# Altium project WR_Cute_Carrier.PrjPcb (part 2 of 2)

## Sheet USB_Serial_Quad.SchDoc: WR_Cute_Carrier
size 420 x 297 mm; Author: G.Kasprowicz; CompanyName: WUT ISE; DrawnBy: G.Kasprowicz; Organization: WUT ISE; Address1: PW ISE; Address2: Nowowiejska 15/19 00-665 Warsaw; Address3: gkasprow@gmail.com; DocumentNumber: 5; Revision: 1; SheetNumber: 5; SheetTotal: 7; ModifiedBy: -; CheckedDate: -; Title2: USB_Serial_Quad; DivGrp: WUT ISE; Designer: G.Kasprowicz; ModifiedDate: -; ProjectName: Sensor Box
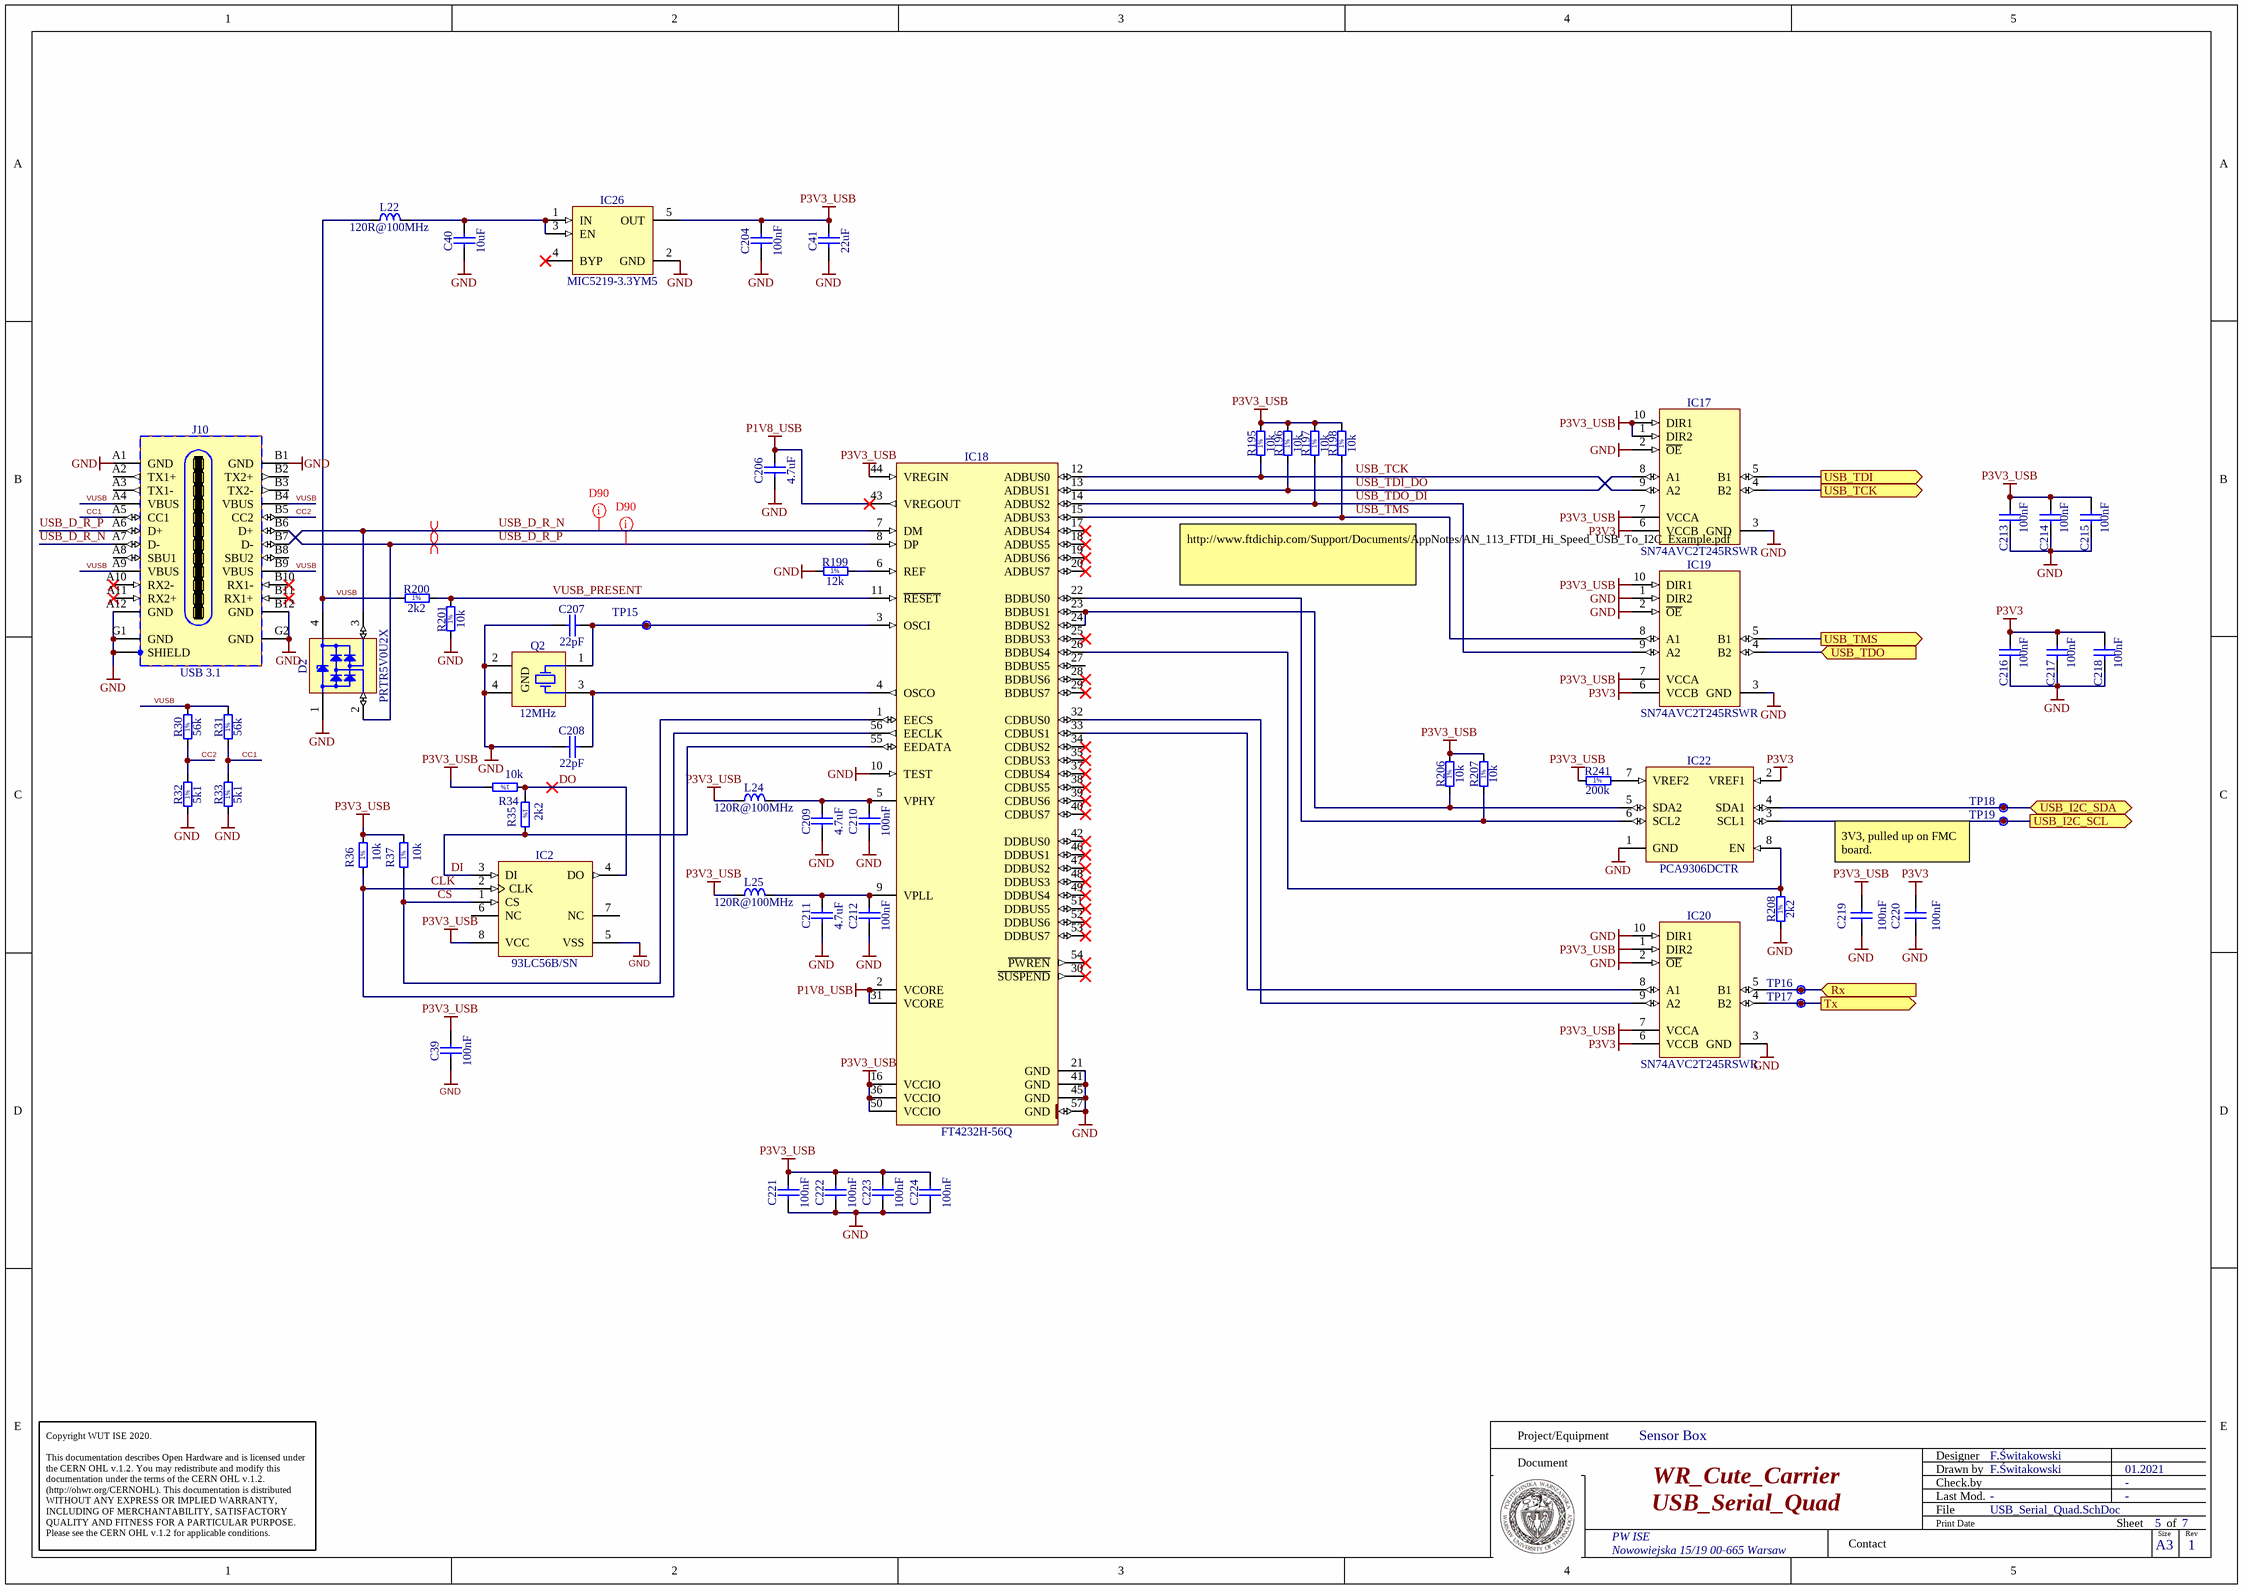
[diagram p4: USB_Serial_Quad.SchDoc]

### Parts
C39  100nF  [CAPC0603X33N]
C40  10uF  [CAPC1005X70N]
C41  22uF  [CAPC2012X135N]
C204  100nF  [CAPC0603X33N]
C206  4.7uF  [CAPC2012X135N]
C207  22pF  [CAPC1005X55N]
C208  22pF  [CAPC1005X55N]
C209  4.7uF  [CAPC2012X135N]
C210  100nF  [CAPC0603X33N]
C211  4.7uF  [CAPC2012X135N]
C212  100nF  [CAPC0603X33N]
C213  100nF  [CAPC0603X33N]
C214  100nF  [CAPC0603X33N]
C215  100nF  [CAPC0603X33N]
C216  100nF  [CAPC0603X33N]
C217  100nF  [CAPC0603X33N]
C218  100nF  [CAPC0603X33N]
C219  100nF  [CAPC0603X33N]
C220  100nF  [CAPC0603X33N]
C221  100nF  [CAPC0603X33N]
C222  100nF  [CAPC0603X33N]
C223  100nF  [CAPC0603X33N]
C224  100nF  [CAPC0603X33N]
D2  PRTR5V0U2X  [SOT190P230X110-4N]
IC2  93LC56B/SN  [SOIC127P600X175-8N]
IC17  SN74AVC2T245RSWR  [QFN40P140X180X55-10N]
IC18  FT4232H-56Q  [QFN50P800X800X100-57N-S620]
IC19  SN74AVC2T245RSWR  [QFN40P140X180X55-10N]
IC20  SN74AVC2T245RSWR  [QFN40P140X180X55-10N]
IC22  PCA9306DCTR  [SOP65P400X130-8N]
IC26  MIC5219-3.3YM5  [SOT95P280X145-5N]
J10  USB 3.1  [WURTH_632723100011]
L22  120R@100MHz  [INDC1608X65N]
L24  120R@100MHz  [INDC1608X65N]
L25  120R@100MHz  [INDC1608X65N]
Q2  12MHz  [XTAL_TXC_7M]
R30  56k  [RESC1005X40N]
R31  56k  [RESC1005X40N]
R32  5k1  [RESC1005X40N]
R33  5k1  [RESC1005X40N]
R34  10k  [RESC1005X40N]
R35  2k2  [RESC1005X40N]
R36  10k  [RESC1005X40N]
R37  10k  [RESC1005X40N]
R195  10k  [RESC1005X40N]
R196  10k  [RESC1005X40N]
R197  10k  [RESC1005X40N]
R198  10k  [RESC1005X40N]
R199  12k  [RESC1005X40N]
R200  2k2  [RESC1005X40N]
R201  10k  [RESC1005X40N]
R206  10k  [RESC1005X40N]
R207  10k  [RESC1005X40N]
R208  2k2  [RESC1005X40N]
R241  200k  [RESC1005X40N]
TP15  Q2  [TPS127]  (value not drawn)  (no BOM)
TP16  RxD  [TPS127]  (value not drawn)  (no BOM)
TP17  TxD  [TPS127]  (value not drawn)  (no BOM)
TP18  USB I2C SDA  [TPS127]  (value not drawn)  (no BOM)
TP19  USB I2C SCL  [TPS127]  (value not drawn)  (no BOM)

### Ports
Rx (in), Tx (out), USB_I2C_SCL (out), USB_I2C_SDA (bidir), USB_TCK (out), USB_TDI (out), USB_TDO (in), USB_TMS (out)

### Nets
GND: C39.1 C40.1 C41.1 C204.1 C206.1 C207.1 C208.1 C209.1 C210.1 C211.1 C212.1 C213.1 C214.1 C215.1 C216.1 C217.1 C218.1 C219.1 C220.1 C221.1 C222.1 C223.1 C224.1 D2.1(GND) IC2.5(VSS) IC17.2(~{OE}) IC17.3(GND) IC18.10(TEST) IC18.21(GND) IC18.41(GND) IC18.45(GND) IC18.57(GND) IC19.1(DIR2) IC19.2(~{OE}) IC19.3(GND) IC20.2(~{OE}) IC20.3(GND) IC20.10(DIR1) IC22.1(GND) IC26.2(GND) J10.A1(GND) J10.A12(GND) J10.B1(GND) J10.B12(GND) J10.G1(GND) J10.G2(GND) J10.SHIELD Q2.2(GND) Q2.4(GND) R32.1 R33.1 R199.1 R201.1 R208.1
P1V8_USB: C206.2 IC18.2(VCORE) IC18.31(VCORE) IC18.43(VREGOUT)
P3V3: C216.2 C217.2 C218.2 C220.2 IC17.6(VCCB) IC19.6(VCCB) IC20.6(VCCB) IC22.2(VREF1)
P3V3_USB: C39.2 C41.2 C204.2 C213.2 C214.2 C215.2 C219.2 C221.2 C222.2 C223.2 C224.2 IC2.8(VCC) IC17.1(DIR2) IC17.7(VCCA) IC17.10(DIR1) IC18.16(VCCIO) IC18.36(VCCIO) IC18.44(VREGIN) IC18.50(VCCIO) IC19.7(VCCA) IC19.10(DIR1) IC20.1(DIR2) IC20.7(VCCA) IC26.5(OUT) L24.1 L25.1 R34.2 R36.2 R37.2 R195.2 R196.2 R197.2 R198.2 R206.2 R207.2 R241.1
CC1: J10.A5(CC1) R31.1 R33.2
CC2: J10.B5(CC2) R30.1 R32.2
CLK: IC2.2(CLK) IC18.56(EECLK) R36.1
CS: IC2.1(CS) IC18.1(EECS) R37.1
DI: IC2.3(DI) IC18.55(EEDATA) R35.2
DO: IC2.4(DO) R34.1 R35.1
LA22_N: IC20.5(B1) TP16.1 ; port Rx
LA22_P: IC20.4(B2) TP17.1 ; port Tx
SCL: IC22.3(SCL1) TP19.1 ; port USB_I2C_SCL
SDA: IC22.4(SDA1) TP18.1 ; port USB_I2C_SDA
USB_D_R_N: D2.3(I/O2) IC18.7(DM) J10.A7(D-) J10.B7(D-)
USB_D_R_P: D2.2(I/O1) IC18.8(DP) J10.A6(D+) J10.B6(D+)
USB_TCK: IC17.9(A2) IC18.12(ADBUS0) R195.1
USB_TDI_DO: IC17.8(A1) IC18.13(ADBUS1) R196.1
USB_TDO_DI: IC18.14(ADBUS2) IC19.9(A2) R197.1
USB_TMS: IC18.15(ADBUS3) IC19.8(A1) R198.1
VUSB: D2.4(VCC) J10.A4(VBUS) J10.A9(VBUS) J10.B4(VBUS) J10.B9(VBUS) L22.1 R30.2 R31.2 R200.1
VUSB_PRESENT: IC18.11(~{RESET}) R200.2 R201.2
NetC40_2: C40.2 IC26.1(IN) IC26.3(EN) L22.2
NetC207_2: C207.2 IC18.3(OSCI) Q2.1(X) TP15.1
NetC208_2: C208.2 IC18.4(OSCO) Q2.3(X)
NetC209_2: C209.2 C210.2 IC18.5(VPHY) L24.2
NetC211_2: C211.2 C212.2 IC18.9(VPLL) L25.2
NetIC17_4: IC17.4(B2) ; port USB_TCK
NetIC17_5: IC17.5(B1) ; port USB_TDI
NetIC18_6: IC18.6(REF) R199.2
NetIC18_22: IC18.22(BDBUS0) IC22.6(SCL2) R207.1
NetIC18_23: IC18.23(BDBUS1) IC18.24(BDBUS2) IC22.5(SDA2) R206.1
NetIC18_26: IC18.26(BDBUS4) IC22.8(EN) R208.2
NetIC18_32: IC18.32(CDBUS0) IC20.9(A2)
NetIC18_33: IC18.33(CDBUS1) IC20.8(A1)
NetIC19_4: IC19.4(B2) ; port USB_TDO
NetIC19_5: IC19.5(B1) ; port USB_TMS
NetIC22_7: IC22.7(VREF2) R241.2

Not connected (* = marked no-connect by the designer): IC2 6(NC) 7(NC); IC18 17(ADBUS4)* 18(ADBUS5)* 19(ADBUS6)* 20(ADBUS7)* 25(BDBUS3)* 27(BDBUS5) 28(BDBUS6)* 29(BDBUS7)* 30(~{SUSPEND})* 34(CDBUS2)* 35(CDBUS3)* 37(CDBUS4)* 38(CDBUS5)* 39(CDBUS6)* 40(CDBUS7)* 42(DDBUS0)* 46(DDBUS1)* 47(DDBUS2)* 48(DDBUS3)* 49(DDBUS4)* 51(DDBUS5)* 52(DDBUS6)* 53(DDBUS7)* 54(~{PWREN})*; IC26 4(BYP)*; J10 A2(TX1+) A3(TX1-) A8(SBU1) A10(RX2-)* A11(RX2+)* B2(TX2+) B3(TX2-) B8(SBU2) B10(RX1-)* B11(RX1+)*

### Layout directives
differential pair; differential pair class Diff_90Ohm: USB_D_R_N, USB_D_R_P
net class D90: USB_D_R_N, USB_D_R_P

### Notes on the sheet
- http://www.ftdichip.com/Support/Documents/AppNotes/AN_113_FTDI_Hi_Speed_USB_To_I2C_Example.pdf
- 3V3, pulled up on FMC board.
- Project/Equipment
- Document
- Designer
- Drawn by
- Check.by
- F.Świtakowski
- 01.2021
- Copyright WUT ISE 2020.
  This documentation describes Open Hardware and is licensed under the CERN OHL v.1.2. You may redistribute and modify this documentation under the terms of the CERN OHL v.1.2. (http://ohwr.org/CERNOHL). This documentation is distributed WITHOUT ANY EXPRESS OR IMPLIED WARRANTY, INCLUDING OF MERCHANTABILITY, SATISFACTORY QUALITY AND FITNESS FOR A PARTICULAR PURPOSE. Please see the CERN OHL v.1.2 for applicable conditions.
- PW ISE
- Contact
- File
- Last Mod.
- Print Date
- Sheet
- Size
- A3
- of
- Rev
- Nowowiejska 15/19 00-665 Warsaw
- (in symbol R0402_2K2_1%_0.0625W_100PPM) 1%
- (in symbol R0402_5K1_1%_0.0625W_100PPM) 1%
- (in symbol R0402_10K_1%_0.0625W_100PPM) 1%
- (in symbol R0402_12K_1%_0.0625W_100PPM) 1%
- (in symbol R0402_56K_1%_0.0625W_100PPM) 1%
- (in symbol R0402_200K_1%_0.0625W_100PPM) 1%

### Library data of the parts
C39 C204 C210 C212-C224 = CC0201_100NF_6.3V_10%_X5R: Non-polarised capacitor; Part Description: SMD Multilayer Chip Ceramic Capacitor; Manufacturer: GENERIC; Manufacturer1 Part Number: 02016D104KAT2A; Voltage: 6.3V; TC: X5R; Tolerance: ±10%; Part Number: CC0201_100NF_6.3V_10%_X5R; Component Kind: Standard; Component Type: Standard; Pin Count: 2; Value: 100nF; Status: Not Recommended; Manufacturer Part Number: CC0201_100NF_6.3V_10%_X5R; Case: 0201; Mounted: Yes; Socket: No; SMD: Yes; Sense: No; Manufacturer1 Example: AVX; Manufacturer1 ComponentHeight: 0.33mm; HelpURL: \\cern.ch\dfs\Applications\Altium\Datasheets\CC0201_X5R_AVX.pdf; Author: CERN DEM JLC
  C39 C204 C210 C212 C221-C224: CreateDate: 03.12.2007; LatestRevisionDate: 03.12.2007
  C213-C220: CreateDate: 2007-12-03; LatestRevisionDate: 2007-12-03
C40 = CC0402_10UF_6.3V_20%_X5R: Non-polarised capacitor; Part Description: SMD Multilayer Chip Ceramic Capacitor; Manufacturer: GENERIC; Manufacturer1 Part Number: C1005X5R0J106M050BC; Voltage: 6.3V; TC: X5R; Tolerance: ±10%; Part Number: CC0402_10UF_6.3V_20%_X5R; Component Kind: Standard; Component Type: Standard; Pin Count: 2; Value: 10uF; Status: Preferred; Manufacturer Part Number: CC0402_10UF_6.3V_20%_X5R; Case: 0402; Mounted: Yes; Socket: No; SMD: Yes; Manufacturer1 Example: TDK; Manufacturer1 ComponentHeight: 0.70mm; HelpURL: \\cern.ch\dfs\Applications\Altium\Datasheets\CC0402_X5R_TDK_C.pdf; Author: CERN DEM JLC; CreateDate: 07.01.2015; LatestRevisionDate: 07.01.2015; Sense: No
C41 = CC0805_22UF_16V_10%_X5R: Non-polarised capacitor; Part Description: SMD Multilayer Chip Ceramic Capacitor; Manufacturer: GENERIC; Manufacturer1 Part Number: C2012X5R1C226KT; Voltage: 16V; TC: X5R; Tolerance: ±10%; Part Number: CC0805_22UF_16V_10%_X5R; Component Kind: Standard; Component Type: Standard; Pin Count: 2; Value: 22uF; Status: Preferred; Manufacturer Part Number: CC0805_22UF_16V_10%_X5R; Case: 0805; Mounted: Yes; Socket: No; SMD: Yes; Sense: No; Manufacturer1 Example: TDK; Manufacturer1 ComponentHeight: 1.35mm; HelpURL: \\cern.ch\dfs\Applications\Altium\Datasheets\CC0805_X5R_TDK_C.pdf; Author: CERN DEM JLC; CreateDate: 25/10/2012; LatestRevisionDate: 25/10/2012
C206 C209 C211 = CC0805_4.7UF_10V_10%_X5R: Non-polarised capacitor; Part Description: SMD Multilayer Chip Ceramic Capacitor; Manufacturer: GENERIC; Manufacturer1 Part Number: 222224013672; Voltage: 10V; TC: X5R; Tolerance: ±10%; Part Number: CC0805_4.7UF_10V_10%_X5R; Component Kind: Standard; Component Type: Standard; Pin Count: 2; Value: 4.7uF; Status: Preferred; Manufacturer Part Number: CC0805_4.7UF_10V_10%_X5R; Case: 0805; Mounted: Yes; Socket: No; SMD: Yes; Sense: No; Manufacturer1 Example: PHYCOMP; Manufacturer1 ComponentHeight: 1.45mm; HelpURL: \\cern.ch\dfs\Applications\Altium\Datasheets\CC0805_X5R_PHYCOMP_HC.pdf; Author: CERN DEM JLC; CreateDate: 03.12.2007; LatestRevisionDate: 03.12.2007
C207 C208 = CC0402_22PF_50V_5%_C0G: Non-polarised capacitor; Part Description: SMD Multilayer Chip Ceramic Capacitor; Manufacturer: GENERIC; Manufacturer1 Part Number: C0402C220J5GACTU; Voltage: 50V; TC: C0G/NP0; Tolerance: ±5%; Part Number: CC0402_22PF_50V_5%_C0G; Component Kind: Standard; Component Type: Standard; Pin Count: 2; Value: 22pF; Status: Preferred; Manufacturer Part Number: CC0402_22PF_50V_5%_C0G; Case: 0402; Mounted: Yes; Socket: No; SMD: Yes; Sense: No; Manufacturer1 Example: KEMET; Manufacturer1 ComponentHeight: 0.55mm; HelpURL: \\cern.ch\dfs\Applications\Altium\Datasheets\CC0805_C0G_KEMET_(Commercial Grade).pdf; Author: CERN DEM JLC; CreateDate: 03.12.2007; LatestRevisionDate: 03.12.2007
D2 = PRTR5V0U2X: Ultra Low Capacitance Double Rail-to-Rail ESD Protection Diode; Part Description: Ultra Low Capacitance (1pF) Double Rail-to-Rail ESD Protection Diode (8kV); Manufacturer: NXP SEMICONDUCTORS; Voltage: 5.5V; PressFit: No; Bonding: No; Part Number: PRTR5V0U2X; Component Kind: Standard; Component Type: Standard; Device: PRTR5V0U2X; PackageDescription: SOT143B, SOT, 1.90mm Pitch; 4 Pin, 1.30mm W X 2.90mm L X 1.10mm H body, IPC Medium Density; Manufacturer Part Number: PRTR5V0U2X; Pin Count: 4; Case: SOT143B; Mounted: Yes; Socket: No; SMD: Yes; Sense: No; ComponentHeight: 1.1mm; HelpURL: \\cern.ch\dfs\Applications\Altium\Datasheets\PRTR5V0U2X.pdf; Author: CERN DEM JLC; CreateDate: 22.03.2011; LatestRevisionDate: 22.03.2011
IC2 = 93C46B-I/SN: 1Kbit, 5V, MICROWIRE® Serial EEPROM With 16-Bit Organization; Manufacturer: MICROCHIP TECHNOLOGY; PressFit: No; Bonding: No; Part Number: 93C46B-I/SN; Component Kind: Standard; Component Type: Standard; Device: 93LC56B/SN; PackageDescription: SOIC 8, Pitch 1.27mm - Body 4x5mm, IPC Medium Density; Part Description: 1Kbit, 5V, MICROWIRE® Serial EEPROM With 16-Bit Organization; Manufacturer Part Number: 93LC56B/SN; Pin Count: 8; Case: SOIC8; Mounted: Yes; Socket: No; SMD: Yes; Sense: No; ComponentHeight: 1.75mm; HelpURL: \\cern.ch\dfs\Applications\Altium\Datasheets\93C46B-ISN.pdf; Author: CERN DEM BC; CreateDate: 14.02.2020; LatestRevisionDate: 14.02.2020
IC17 IC19 IC20 = SN74AVC2T245RSWR: Dual-Bit Dual-Supply Bus Transceiver With Configurable Voltage Translation and 3-State Outputs; Manufacturer: TEXAS INSTRUMENTS; PressFit: No; Bonding: No; Part Number: SN74AVC2T245RSWR; Component Kind: Standard; Component Type: Standard; Device: SN74AVC2T245RSWR; PackageDescription: QFN, 0.40mm Pitch, Rect.;10 Pin, 1.80mm L X 1.40mm W X 0.55mm H Body, IPC Medium Density; Status: Not Recommended; Part Description: Dual-Bit Dual-Supply Bus Transceiver With Configurable Voltage Translation and 3-State Outputs; Manufacturer Part Number: SN74AVC2T245RSWR; Pin Count: 10; Case: QFN10; Mounted: Yes; Socket: No; SMD: Yes; Sense: No; ComponentHeight: 0.55mm; Author: CERN DEM JLC; HelpURL: \\cern.ch\dfs\Applications\Altium\Datasheets\SN74AVC2T245RSWR.pdf; CreateDate: 07.07.2014; LatestRevisionDate: 30.03.2017
IC18 = FT4232H-56Q: Quad High Speed USB to Multipurpose UART/MPSSE IC; Manufacturer: FUTURE TECHNOLOGY DEVICES INTERNATIONAL (FTDI); PressFit: No; Bonding: No; Part Number: FT4232H-56Q; Component Kind: Standard; Component Type: Standard; Device: FT4232H-56Q; PackageDescription: QFN, 0.50mm Pitch, Square; 56 Pin, 8.00mm L X 8.00mm W X 1.00mm H body (6.1mm X 6.1mm Thermal tab), IPC Medium Density; Part Description: Quad High Speed USB to Multipurpose UART/MPSSE IC; Manufacturer Part Number: FT4232H-56Q; Pin Count: 57; Case: QFN56; Mounted: Yes; Socket: No; SMD: Yes; Sense: No; ComponentHeight: 1mm; Author: CERN DEM JLC; HelpURL: \\cern.ch\dfs\Applications\Altium\Datasheets\FT4232H-56Q.pdf; CreateDate: 11.10.2016; LatestRevisionDate: 11.10.2016
IC22 = PCA9306DCTR: Dual Bidirectional I2C Bus And SMBus Voltage-Level Translator; Manufacturer: TEXAS INSTRUMENTS; PressFit: No; Bonding: No; Part Number: PCA9306DCTR; Component Kind: Standard; Component Type: Standard; Device: PCA9306DCTR; PackageDescription: SOP, 0.65mm, Pitch; 8 Pin, 2.80mm W X 2.95mm L X 1.30mm H Body, PC Medium Density; Part Description: Dual Bidirectional I2C Bus And SMBus Voltage-Level Translator; Manufacturer Part Number: PCA9306DCTR; Pin Count: 8; Case: SSOP8; Mounted: Yes; Socket: No; SMD: Yes; Sense: No; ComponentHeight: 1.3mm; Author: CERN DEM JLC; HelpURL: \\cern.ch\dfs\Applications\Altium\Datasheets\PCA9306DCTR.pdf; CreateDate: 25.02.2013; LatestRevisionDate: 11.02.2016
IC26 = MIC5219-3.3YM5: 500mA Peak Output LDO Regulator; Part Description: 3.3V 500mA Peak Output Low Drop-Out  (LDO) Regulator; Manufacturer: MICROCHIP TECHNOLOGY; PressFit: No; Bonding: No; Part Number: MIC5219-3.3YM5; Component Kind: Standard; Component Type: Standard; Device: MIC5219-3.3YM5; PackageDescription: SOT, 0.95mm pitch; 5 pin, 1.60mm W X 2.90mm L X 1.45mm H body, IPC Medium Density; Manufacturer Part Number: MIC5219-3.3YM5; Pin Count: 5; Case: SOT23-5; Mounted: Yes; Socket: No; SMD: Yes; Sense: No; ComponentHeight: 1.45mm; HelpURL: \\cern.ch\dfs\Applications\Altium\Datasheets\MIC5219-3.3YM5.pdf; Author: CERN DEM WB; CreateDate: 2019-04-16; LatestRevisionDate: 2019-04-16
J10 = WURTH_632723100011: 2x12 Pin + 2GND + 1 Shield  USB Type C Receptacle; Part Description: WR-COM USB 3.1 Type C, Right Angle, Receptacle Horizontal THT/SMT; Manufacturer: WURTH ELEKTRONIK; PressFit: No; Part Number: WURTH_632723100011; Component Kind: Standard; Component Type: Standard; Pin Count: 28; Family: USB 3.1; Mounted: Yes; Socket: No; SMD: Yes; Sense: No; Status: None; Manufacturer Part Number: 632723100011; ComponentHeight: 3.16mm; HelpURL: \\cern.ch\dfs\Applications\Altium\Datasheets\WURTH_632723100011.pdf; Author: CERN DEM BC; CreateDate: 14.02.2020; LatestRevisionDate: 14.02.2020
L22 L24 L25 = IND0603_MURATA_BLM18SG121TN1D: Inductor; Part Description: SMD EMIFIL Suppression Chip Ferrite Bead; Manufacturer: MURATA; Power: 3A; Resistance: 0.025R; Tolerance: ±25%; Part Number: IND0603_MURATA_BLM18SG121TN1D; Component Kind: Standard; Component Type: Standard; Pin Count: 2; Value: 120R@100MHz; Status: None; Manufacturer Part Number: BLM18SG121TN1D; Case: 0603; Mounted: Yes; Socket: No; SMD: Yes; Sense: No; ComponentHeight: 0.65mm; HelpURL: \\cern.ch\dfs\Applications\Altium\Datasheets\IND0603_MURATA_BLM18S.pdf; Author: CERN DEM JLC; CreateDate: 23.07.2014; LatestRevisionDate: 23.07.2014
Q2 = XTAL_12MHZ_TXC_7M-12.000MAAJ-T: Crystal 4 pins 1=XTAL Control 2=GND3=XTAL 4=GND; Part Description: ±30ppm 18pF -20°C to +70°C  4 Pins, 3.2x2.5X0.8mm, SMD Sealing Crystal, 7M Series; Manufacturer: TXC CORPORATION; PressFit: No; Bonding: No; Part Number: XTAL_12MHZ_TXC_7M-12.000MAAJ-T; Component Kind: Standard; Component Type: Standard; PackageDescription: 4 Pins, 2.5x3.2mm, SMD Sealing Crystal, 7M Serie; Value: 12MHz; Manufacturer Part Number: 7M-12.000MAAJ-T; Pin Count: 4; Mounted: Yes; Socket: No; SMD: Yes; Sense: No; ComponentHeight: 0.8mm; HelpURL: \\cern.ch\dfs\Applications\Altium\Datasheets\XTAL_TXC_7M.pdf; Author: CERN DEM JLC; CreateDate: 19.06.2012; LatestRevisionDate: 19.06.2012
R30 R31 = R0402_56K_1%_0.0625W_100PPM: Resistor - 1%; Part Description: General Purpose Thick Film Chip Resistor; Manufacturer: GENERIC; Manufacturer1 Part Number: 232270675603L; TC: ±100ppm/°C; PressFit: No; Part Number: R0402_56K_1%_0.0625W_100PPM; Component Kind: Standard; Component Type: Standard; Pin Count: 2; Value: 56k; Status: Not Recommended; Power: 0.0625W; Tolerance: ±1%; Manufacturer Part Number: R0402_56K_1%_0.0625W_100PPM; Case: 0402; Mounted: Yes; Sense: No; Socket: No; SMD: Yes; Manufacturer1 Example: YAGEO PHYCOMP; Manufacturer1 ComponentHeight: 0.4mm; HelpURL: \\cern.ch\dfs\Applications\Altium\Datasheets\R0402_Phycomp_RC0402.pdf; Author: CERN DEM JLC; CreateDate: 03.12.2007; LatestRevisionDate: 17.10.2012
R32 R33 = R0402_5K1_1%_0.0625W_100PPM: Resistor - 1%; Part Description: General Purpose Thick Film Chip Resistor; Manufacturer: GENERIC; Manufacturer1 Part Number: 232270675102L; TC: ±100ppm/°C; PressFit: No; Part Number: R0402_5K1_1%_0.0625W_100PPM; Component Kind: Standard; Component Type: Standard; Pin Count: 2; Value: 5k1; Status: Not Recommended; Power: 0.0625W; Tolerance: ±1%; Manufacturer Part Number: R0402_5K1_1%_0.0625W_100PPM; Case: 0402; Mounted: Yes; Sense: No; Socket: No; SMD: Yes; Manufacturer1 Example: YAGEO PHYCOMP; Manufacturer1 ComponentHeight: 0.4mm; HelpURL: \\cern.ch\dfs\Applications\Altium\Datasheets\R0402_Phycomp_RC0402.pdf; Author: CERN DEM JLC; CreateDate: 03.12.2007; LatestRevisionDate: 17.10.2012
R34 R36 R37 = R0402_10K_1%_0.0625W_100PPM: Resistor - 1%; Manufacturer: GENERIC; Part Description: General Purpose Thick Film Chip Resistor; Manufacturer1 Part Number: 232270671003L; TC: ±100ppm/°C; PressFit: No; Manufacturer Part Number: R0402_10K_1%_0.0625W_100PPM; Part Number: R0402_10K_1%_0.0625W_100PPM; Tolerance: ±1%; Value: 10k; Component Kind: Standard; Component Type: Standard; Pin Count: 2; Status: Not Recommended; Power: 0.0625W; Case: 0402; Mounted: Yes; Sense: No; Socket: No; SMD: Yes; Manufacturer1 Example: YAGEO PHYCOMP; Manufacturer1 ComponentHeight: 0.4mm; HelpURL: \\cern.ch\dfs\Applications\Altium\Datasheets\R0402_Phycomp_RC0402.pdf; Author: CERN DEM JLC; CreateDate: 03/12/2007; LatestRevisionDate: 17/10/2012
R35 = R0402_2K2_1%_0.0625W_100PPM: Resistor - 1%; Manufacturer: GENERIC; Part Description: General Purpose Thick Film Chip Resistor; Manufacturer1 Part Number: 232270672202L; TC: ±100ppm/°C; PressFit: No; Manufacturer Part Number: R0402_2K2_1%_0.0625W_100PPM; Part Number: R0402_2K2_1%_0.0625W_100PPM; Tolerance: ±1%; Value: 2k2; Component Kind: Standard; Component Type: Standard; Pin Count: 2; Status: Not Recommended; Power: 0.0625W; Case: 0402; Mounted: Yes; Sense: No; Socket: No; SMD: Yes; Manufacturer1 Example: YAGEO PHYCOMP; Manufacturer1 ComponentHeight: 0.4mm; HelpURL: \\cern.ch\dfs\Applications\Altium\Datasheets\R0402_Phycomp_RC0402.pdf; Author: CERN DEM JLC; CreateDate: 03/12/2007; LatestRevisionDate: 17/10/2012
R195-R198 R201 R206 R207 = R0402_10K_1%_0.0625W_100PPM: Resistor - 1%; Part Description: General Purpose Thick Film Chip Resistor; Manufacturer: GENERIC; Manufacturer1 Part Number: 232270671003L; TC: ±100ppm/°C; PressFit: No; Part Number: R0402_10K_1%_0.0625W_100PPM; Component Kind: Standard; Component Type: Standard; Pin Count: 2; Value: 10k; Status: Not Recommended; Power: 0.0625W; Tolerance: ±1%; Manufacturer Part Number: R0402_10K_1%_0.0625W_100PPM; Case: 0402; Mounted: Yes; Socket: No; SMD: Yes; Manufacturer1 Example: YAGEO PHYCOMP; Manufacturer1 ComponentHeight: 0.4mm; HelpURL: \\cern.ch\dfs\Applications\Altium\Datasheets\R0402_Phycomp_RC0402.pdf; Author: CERN DEM JLC; CreateDate: 03.12.2007; LatestRevisionDate: 17.10.2012; Sense: No
R199 = R0402_12K_1%_0.0625W_100PPM: Resistor - 1%; Part Description: General Purpose Thick Film Chip Resistor; Manufacturer: GENERIC; Manufacturer1 Part Number: 232270671203L; TC: ±100ppm/°C; PressFit: No; Part Number: R0402_12K_1%_0.0625W_100PPM; Component Kind: Standard; Component Type: Standard; Pin Count: 2; Value: 12k; Status: Not Recommended; Power: 0.0625W; Tolerance: ±1%; Manufacturer Part Number: R0402_12K_1%_0.0625W_100PPM; Case: 0402; Mounted: Yes; Sense: No; Socket: No; SMD: Yes; Manufacturer1 Example: YAGEO PHYCOMP; Manufacturer1 ComponentHeight: 0.4mm; HelpURL: \\cern.ch\dfs\Applications\Altium\Datasheets\R0402_Phycomp_RC0402.pdf; Author: CERN DEM JLC; CreateDate: 03.12.2007; LatestRevisionDate: 17.10.2012
R200 R208 = R0402_2K2_1%_0.0625W_100PPM: Resistor - 1%; Part Description: General Purpose Thick Film Chip Resistor; Manufacturer: GENERIC; Manufacturer1 Part Number: 232270672202L; TC: ±100ppm/°C; PressFit: No; Part Number: R0402_2K2_1%_0.0625W_100PPM; Component Kind: Standard; Component Type: Standard; Pin Count: 2; Value: 2k2; Status: Not Recommended; Power: 0.0625W; Tolerance: ±1%; Manufacturer Part Number: R0402_2K2_1%_0.0625W_100PPM; Case: 0402; Mounted: Yes; Sense: No; Socket: No; SMD: Yes; Manufacturer1 Example: YAGEO PHYCOMP; Manufacturer1 ComponentHeight: 0.4mm; HelpURL: \\cern.ch\dfs\Applications\Altium\Datasheets\R0402_Phycomp_RC0402.pdf; Author: CERN DEM JLC; CreateDate: 03.12.2007; LatestRevisionDate: 17.10.2012
R241 = R0402_200K_1%_0.0625W_100PPM: Resistor - 1%; Part Description: General Purpose Thick Film Chip Resistor; Manufacturer: GENERIC; Manufacturer1 Part Number: 232270672004L; TC: ±100ppm/°C; PressFit: No; Part Number: R0402_200K_1%_0.0625W_100PPM; Component Kind: Standard; Component Type: Standard; Pin Count: 2; Value: 200k; Status: Not Recommended; Power: 0.0625W; Tolerance: ±1%; Manufacturer Part Number: R0402_200K_1%_0.0625W_100PPM; Case: 0402; Mounted: Yes; Sense: No; Socket: No; SMD: Yes; Manufacturer1 Example: YAGEO PHYCOMP; Manufacturer1 ComponentHeight: 0.4mm; HelpURL: \\cern.ch\dfs\Applications\Altium\Datasheets\R0402_Phycomp_RC0402.pdf; Author: CERN DEM JLC; CreateDate: 03.12.2007; LatestRevisionDate: 17.10.2012
TP15-TP19 = SMD_PAD_1.27X1.27MM: Test Point; Part Description: 1.27mm x 1.27mm PCB Copper Area (SMD Test Point); Mounted: No; Part Number: SMD_PAD_1.27X1.27MM; Component Type: Standard (No BOM); Pin Count: 1; Family: Test Point; Socket: No; SMD: Yes; Sense: No; Status: None; ComponentHeight: 0mm; HelpURL: Undefined; Author: CERN DEM JLC; CreateDate: 12.01.2008; LatestRevisionDate: 12.01.2008; PackageDescription: 1.27mm x 1.27mm PCB Copper Area (SMD Test Point)

## Sheet IO_Buffer.SchDoc: WR_Cute_Carrier
size A4; Author: G.Kasprowicz; CompanyName: WUT ISE; DrawnBy: G.Kasprowicz; Organization: WUT ISE; Address1: PW ISE; Address2: Nowowiejska 15/19 00-665 Warsaw; Address3: gkasprow@gmail.com; DocumentNumber: 6; Revision: 2; SheetNumber: 6; SheetTotal: 7; ModifiedBy: -; CheckedDate: -; Title2: IO_Buffer; DivGrp: WUT ISE; Designer: G.Kasprowicz; ModifiedDate: -; ProjectName: Sensor Box
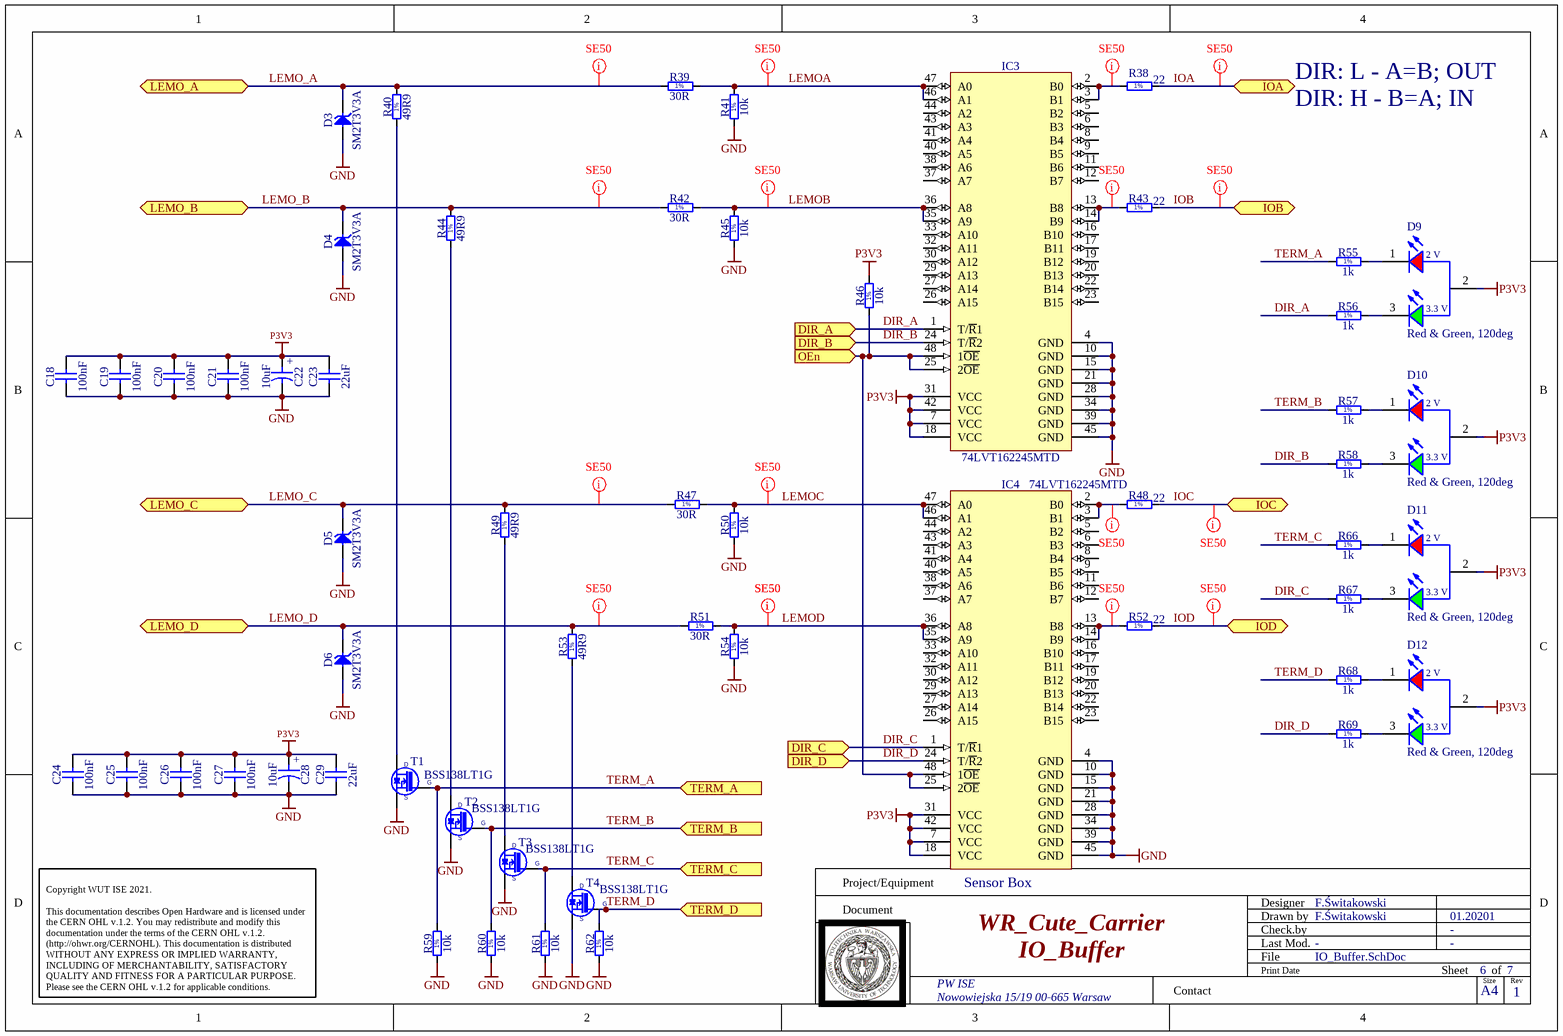
[diagram p5: IO_Buffer.SchDoc]

### Parts
C18  100nF  [CAPC1005X55N]
C19  100nF  [CAPC1005X55N]
C20  100nF  [CAPC1005X55N]
C21  100nF  [CAPC1005X55N]
C22  10uF  [CAPAE430X540N]
C23  22uF  [CAPC2012X135N]
C24  100nF  [CAPC1005X55N]
C25  100nF  [CAPC1005X55N]
C26  100nF  [CAPC1005X55N]
C27  100nF  [CAPC1005X55N]
C28  10uF  [CAPAE430X540N]
C29  22uF  [CAPC2012X135N]
D3  SM2T3V3A  [DO-216AA]
D4  SM2T3V3A  [DO-216AA]
D5  SM2T3V3A  [DO-216AA]
D6  SM2T3V3A  [DO-216AA]
D9  Red & Green, 120deg  [WL-SBSW_1204]
D10  Red & Green, 120deg  [WL-SBSW_1204]
D11  Red & Green, 120deg  [WL-SBSW_1204]
D12  Red & Green, 120deg  [WL-SBSW_1204]
IC3  74LVT162245MTD  [SOP50P810X120-48N]
IC4  74LVT162245MTD  [SOP50P810X120-48N]
R38  22  [RESC1005X40N]
R39  30R  [RESC3225X70N]
R40  49R9  [RESC3225X70N]
R41  10k  [RESC1005X40N]
R42  30R  [RESC3225X70N]
R43  22  [RESC1005X40N]
R44  49R9  [RESC3225X70N]
R45  10k  [RESC1005X40N]
R46  10k  [RESC1005X40N]
R47  30R  [RESC3225X70N]
R48  22  [RESC1005X40N]
R49  49R9  [RESC3225X70N]
R50  10k  [RESC1005X40N]
R51  30R  [RESC3225X70N]
R52  22  [RESC1005X40N]
R53  49R9  [RESC3225X70N]
R54  10k  [RESC1005X40N]
R55  1k  [RESC1005X40N]
R56  1k  [RESC1005X40N]
R57  1k  [RESC1005X40N]
R58  1k  [RESC1005X40N]
R59  10k  [RESC1005X40N]
R60  10k  [RESC1005X40N]
R61  10k  [RESC1005X40N]
R62  10k  [RESC1005X40N]
R66  1k  [RESC1005X40N]
R67  1k  [RESC1005X40N]
R68  1k  [RESC1005X40N]
R69  1k  [RESC1005X40N]
T1  BSS138LT1G  [SOT95P240X110-3N]
T2  BSS138LT1G  [SOT95P240X110-3N]
T3  BSS138LT1G  [SOT95P240X110-3N]
T4  BSS138LT1G  [SOT95P240X110-3N]

### Ports
DIR_A (in), DIR_B (in), DIR_C (in), DIR_D (in), IOA (bidir), IOB (bidir), IOC (bidir), IOD (bidir), LEMO_A (bidir), LEMO_B (bidir), LEMO_C (bidir), LEMO_D (bidir), OEn (in), TERM_A (in), TERM_B (in), TERM_C (in), TERM_D (in)

### Nets
GND: C18.1 C19.1 C20.1 C21.1 C22.2 C23.1 C24.1 C25.1 C26.1 C27.1 C28.2 C29.1 D3.2(A) D4.2(A) D5.2(A) D6.2(A) IC3.4(GND) IC3.10(GND) IC3.15(GND) IC3.21(GND) IC3.28(GND) IC3.34(GND) IC3.39(GND) IC3.45(GND) IC4.4(GND) IC4.10(GND) IC4.15(GND) IC4.21(GND) IC4.28(GND) IC4.34(GND) IC4.39(GND) IC4.45(GND) R41.1 R45.1 R50.1 R54.1 R59.1 R60.1 R61.1 R62.1 T1.2(S) T2.2(S) T3.2(S) T4.2(S)
P3V3: C18.2 C19.2 C20.2 C21.2 C22.1 C23.2 C24.2 C25.2 C26.2 C27.2 C28.1 C29.2 D9.2(A) D10.2(A) D11.2(A) D12.2(A) IC3.7(VCC) IC3.18(VCC) IC3.31(VCC) IC3.42(VCC) IC4.7(VCC) IC4.18(VCC) IC4.31(VCC) IC4.42(VCC) R46.2
DIR_A: IC3.1(T/~{R}1) R56.1 ; port DIR_A
DIR_B: IC3.24(T/~{R}2) R58.1 ; port DIR_B
DIR_C: IC4.1(T/~{R}1) R67.1 ; port DIR_C
DIR_D: IC4.24(T/~{R}2) R69.1 ; port DIR_D
IOA: R38.2 ; port IOA
IOB: R43.2 ; port IOB
IOC: R48.2 ; port IOC
IOD: R52.2 ; port IOD
LA30_P: IC3.25(2~{OE}) IC3.48(1~{OE}) IC4.25(2~{OE}) IC4.48(1~{OE}) R46.1 ; port OEn
LEMO_A: D3.1(C) R39.1 R40.2 ; port LEMO_A
LEMO_B: D4.1(C) R42.1 R44.2 ; port LEMO_B
LEMO_C: D5.1(C) R47.1 R49.2 ; port LEMO_C
LEMO_D: D6.1(C) R51.1 R53.2 ; port LEMO_D
LEMOA: IC3.46(A1) IC3.47(A0) R39.2 R41.2
LEMOB: IC3.35(A9) IC3.36(A8) R42.2 R45.2
LEMOC: IC4.46(A1) IC4.47(A0) R47.2 R50.2
LEMOD: IC4.35(A9) IC4.36(A8) R51.2 R54.2
TERM_A: R55.1 R59.2 T1.1(G) ; port TERM_A  [project net LA19_P]
TERM_B: R57.1 R60.2 T2.1(G) ; port TERM_B  [project net LA19_N]
TERM_C: R61.2 R66.1 T3.1(G) ; port TERM_C  [project net LA15_P]
TERM_D: R62.2 R68.1 T4.1(G) ; port TERM_D  [project net LA15_N]
NetD9_1: D9.1(K) R55.2
NetD9_3: D9.3(K) R56.2
NetD10_1: D10.1(K) R57.2
NetD10_3: D10.3(K) R58.2
NetD11_1: D11.1(K) R66.2
NetD11_3: D11.3(K) R67.2
NetD12_1: D12.1(K) R68.2
NetD12_3: D12.3(K) R69.2
NetIC3_2: IC3.2(B0) IC3.3(B1) R38.1
NetIC3_13: IC3.13(B8) IC3.14(B9) R43.1
NetIC4_2: IC4.2(B0) IC4.3(B1) R48.1
NetIC4_13: IC4.13(B8) IC4.14(B9) R52.1
NetR40_1: R40.1 T1.3(D)
NetR44_1: R44.1 T2.3(D)
NetR49_1: R49.1 T3.3(D)
NetR53_1: R53.1 T4.3(D)

Not connected (* = marked no-connect by the designer): IC3 5(B2) 6(B3) 8(B4) 9(B5) 11(B6) 12(B7) 16(B10) 17(B11) 19(B12) 20(B13) 22(B14) 23(B15) 26(A15) 27(A14) 29(A13) 30(A12) 32(A11) 33(A10) 37(A7) 38(A6) 40(A5) 41(A4) 43(A3) 44(A2); IC4 5(B2) 6(B3) 8(B4) 9(B5) 11(B6) 12(B7) 16(B10) 17(B11) 19(B12) 20(B13) 22(B14) 23(B15) 26(A15) 27(A14) 29(A13) 30(A12) 32(A11) 33(A10) 37(A7) 38(A6) 40(A5) 41(A4) 43(A3) 44(A2)

### Layout directives
net class SE50: IOA, IOB, IOC, IOD, LEMO_A, LEMO_B, LEMO_C, LEMO_D, LEMOA, LEMOB, LEMOC, LEMOD, NetIC3_2, NetIC3_13, NetIC4_2, NetIC4_13

### Notes on the sheet
- DIR: L - A=B; OUT
- DIR: H - B=A; IN
- Project/Equipment
- Document
- Designer
- Drawn by
- Check.by
- F.Świtakowski
- 01.20201
- PW ISE
- Contact
- File
- Last Mod.
- Print Date
- Sheet
- Size
- A4
- of
- 1
- Rev
- Copyright WUT ISE 2021.
  This documentation describes Open Hardware and is licensed under the CERN OHL v.1.2. You may redistribute and modify this documentation under the terms of the CERN OHL v.1.2. (http://ohwr.org/CERNOHL). This documentation is distributed WITHOUT ANY EXPRESS OR IMPLIED WARRANTY, INCLUDING OF MERCHANTABILITY, SATISFACTORY QUALITY AND FITNESS FOR A PARTICULAR PURPOSE. Please see the CERN OHL v.1.2 for applicable conditions.
- Nowowiejska 15/19 00-665 Warsaw
- (in symbol 155124RG73200) 2 V; 3.3 V
- (in symbol CAE430-540_10UF_16V_20%) +
- (in symbol R0402_1K_1%_0.0625W_100PPM) 1%
- (in symbol R0402_10K_1%_0.0625W_100PPM) 1%
- (in symbol R0402_22R_1%_0.0625W_100PPM) 1%
- (in symbol R1210_30R_5%_0.5W_200PPM) 1%
- (in symbol R1210_49R9_1%_0.5W_100PPM_VISHAY_CRCW) 1%

### Library data of the parts
C18-C21 C24-C27 = CC0402_100NF_16V_10%_X5R: Non-polarised capacitor; Part Description: SMD Multilayer Chip Ceramic Capacitor; Manufacturer: GENERIC; Manufacturer1 Part Number: GRM155R61C104KA88D; Voltage: 16V; TC: X5R; Tolerance: ±10%; Part Number: CC0402_100NF_16V_10%_X5R; Component Kind: Standard; Component Type: Standard; Pin Count: 2; Value: 100nF; Status: None; Manufacturer Part Number: CC0402_100NF_16V_10%_X5R; Case: 0402; Mounted: Yes; Socket: No; SMD: Yes; Sense: No; Manufacturer1 Example: MURATA; Manufacturer1 ComponentHeight: 0.55mm; HelpURL: \\cern.ch\dfs\Applications\Altium\Datasheets\CC0402_X5R_MURATA_GRM.pdf; Author: CERN DEM JLC; CreateDate: 10.12.2013; LatestRevisionDate: 10.12.2013
C22 C28 = CAE430-540_10UF_16V_20%: Polarised capacitor; Part Description: Aluminum Electrolytic SMT Capacitor; Manufacturer: PANASONIC; Manufacturer Part Number: EEEFK1C100AR; Voltage: 16V; Tolerance: ±20%; Part Number: CAE430-540_10UF_16V_20%; Component Kind: Standard; Component Type: Standard; Pin Count: 2; Value: 10uF; Status: Not Recommended; Case: B; Mounted: Yes; Socket: No; SMD: Yes; Sense: No; ComponentHeight: 5.8mm; HelpURL: \\cern.ch\dfs\Applications\Altium\Datasheets\CAE_PANASONIC_FK.pdf; Author: CERN DEM JLC; CreateDate: 03.12.2007; LatestRevisionDate: 05.11.2014
C23 C29 = CC0805_22UF_16V_10%_X5R: as C41 on sheet USB_Serial_Quad; Part Number: CC0805_22UF_16V_10%_X5R; Component Kind: Standard; Component Type: Standard; Pin Count: 2; Value: 22uF; Status: Preferred; Manufacturer Part Number: CC0805_22UF_16V_10%_X5R; Case: 0805; Mounted: Yes; Socket: No; SMD: Yes; Sense: No; Manufacturer1 Example: TDK; Manufacturer1 ComponentHeight: 1.35mm; HelpURL: \\cern.ch\dfs\Applications\Altium\Datasheets\CC0805_X5R_TDK_C.pdf; Author: CERN DEM JLC; CreateDate: 25.10.2012; LatestRevisionDate: 25.10.2012
D3-D6 = SM2T3V3A: Transient Voltage Suppressor Diode (Uni-Directional); Part Description: Low voltage Unidirectional Transil™ Diode; Manufacturer: ST MICROELECTRONICS; Voltage: 3V3; Power: 200W; PressFit: No; Bonding: No; Part Number: SM2T3V3A; Component Kind: Standard; Component Type: Standard; Device: SM2T3V3A; PackageDescription: DO-216-AA/SMB Molded Diode, Body 1.9x1.9mm, IPC Medium Density; Manufacturer Part Number: SM2T3V3A; Pin Count: 2; Case: DO-216AA; Mounted: Yes; Socket: No; SMD: Yes; Sense: No; ComponentHeight: 1.15mm; HelpURL: \\cern.ch\dfs\Applications\Altium\Datasheets\SM2T3V3A.pdf; Author: CERN DEM BR; CreateDate: 27.06.2019; LatestRevisionDate: 27.06.2019
D9-D12 = 155124RG73200: WL-SBSW SMT Bi-color Side View Waterclear, size 1204, Red & Green, 120deg; Luminous Intensity: 160mcd@Green, 60mcd@Red; Dominant Wavelength: 525nm@Green, 624nm@Red; Forward Voltage: 3.3V@Green, 2V@Red; Peak Wavelength: 520nm@Green, 632nm@Red; Chip Technology: AlInGaP + InGaN; ComponentLink1Description: Manufacturer; ComponentLink1URL: http://www.we-online.de; ComponentLink2Description: Datasheet; ComponentLink2URL: https://katalog.we-online.de/led/datasheet/155124RG73200.pdf; Emitting Color: Red & Green; Operating Temperature: -40 to +85degC; Mounting Technology: SMT; Part Number: 155124RG73200; Packaging: Tape and Reel; Published Date: October 2019; Publisher: Wurth Elektronik; Size: 1204; Viewing Angle: 120deg
IC3 IC4 = 74LVT162245MTD: Low Voltage 16-Bit Transceiver with 3-STATE Outputs and 25 Ohm Series Resistors in A Port Outputs; Manufacturer: FAIRCHILD SEMICONDUCTOR; PressFit: No; Bonding: No; Part Number: 74LVT162245MTD; Component Kind: Standard; Component Type: Standard; Device: 74LVT162245MTD; PackageDescription: SOP, 48-Leads, Body 12.6x6.2mm (max), Pitch 0.50mm, IPC Medium Density; Part Description: Low Voltage 16-Bit Transceiver with 3-STATE Outputs and 25 Ohm Series Resistors in A Port Outputs; Manufacturer Part Number: 74LVT162245MTD; Pin Count: 48; Case: TSSOP48; Mounted: Yes; Socket: No; SMD: Yes; Sense: No; ComponentHeight: 1.2mm; Author: CERN DEM MR; HelpURL: \\cern.ch\dfs\Applications\Altium\Datasheets\74LVT162245MTD.pdf; CreateDate: 06.12.2016; LatestRevisionDate: 06.12.2016
R38 R43 R48 R52 = R0402_22R_1%_0.0625W_100PPM: Resistor - 1%; Part Description: General Purpose Thick Film Chip Resistor; Manufacturer: GENERIC; Manufacturer1 Part Number: 232270672209L; TC: ±100ppm/°C; PressFit: No; Part Number: R0402_22R_1%_0.0625W_100PPM; Component Kind: Standard; Component Type: Standard; Pin Count: 2; Value: 22; Status: Not Recommended; Power: 0.0625W; Tolerance: ±1%; Manufacturer Part Number: R0402_22R_1%_0.0625W_100PPM; Case: 0402; Mounted: Yes; Sense: No; Socket: No; SMD: Yes; Manufacturer1 Example: YAGEO PHYCOMP; Manufacturer1 ComponentHeight: 0.4mm; HelpURL: \\cern.ch\dfs\Applications\Altium\Datasheets\R0402_Phycomp_RC0402.pdf; Author: CERN DEM JLC; CreateDate: 03.12.2007; LatestRevisionDate: 17.10.2012
R39 R42 R47 R51 = R1210_30R_5%_0.5W_200PPM: Resistor - 5%; Part Description: Thick Film Chip Resistor; Manufacturer: VISHAY; Manufacturer Part Number: CRCW121030R0JNEA; Power: 0.5W; TC: ±200ppm/°C; PressFit: No; Part Number: R1210_30R_5%_0.5W_200ppm; Component Kind: Standard; Component Type: Standard; Pin Count: 2; Value: 30R; Status: None; Tolerance: ±5%; Case: 1210; Mounted: Yes; Sense: No; Socket: No; SMD: Yes; HelpURL: \\cern.ch\dfs\Applications\Altium\Datasheets\R1210_VISHAY_CRCW1210.pdf; Author: CERN DEM JMW; CreateDate: 06.08.2014; LatestRevisionDate: 06.08.2014; ComponentHeight: 0.6mm
R40 R44 R49 R53 = R1210_49R9_1%_0.5W_100PPM_VISHAY_CRCW: Resistor - 1%; Part Description: Thick Film Chip Resistor; Manufacturer: VISHAY DRALORIC; Manufacturer Part Number: CRCW121049R9FKTA; Power: 0.5W; TC: ±100ppm/°C; Part Number: R1210_49R9_1%_0.5W_100PPM_VISHAY_CRCW; Component Kind: Standard; Component Type: Standard; Pin Count: 2; Value: 49R9; Status: None; Tolerance: ±1%; Case: 1210; Mounted: Yes; Sense: No; Socket: No; SMD: Yes; ComponentHeight: 0.6mm; HelpURL: \\cern.ch\dfs\Applications\Altium\Datasheets\R1210_VISHAY_CRCW1210.pdf; Author: CERN DEM JMW; CreateDate: 06.08.2014; LatestRevisionDate: 06.08.2014
R41 R45 R46 R50 R54 R59-R62 = R0402_10K_1%_0.0625W_100PPM: Resistor - 1%; Part Description: General Purpose Thick Film Chip Resistor; Manufacturer: GENERIC; Manufacturer1 Part Number: 232270671003L; TC: ±100ppm/°C; Part Number: R0402_10K_1%_0.0625W_100PPM; Component Kind: Standard; Component Type: Standard; Pin Count: 2; Value: 10k; Status: Not recommended; Power: 0.0625W; Tolerance: ±1%; Manufacturer Part Number: R0402_10K_1%_0.0625W_100PPM; Case: 0402; Mounted: Yes; Sense: No; Socket: No; SMD: Yes; Manufacturer1 Example: YAGEO PHYCOMP; Manufacturer1 ComponentHeight: 0.4mm; HelpURL: \\cern.ch\dfs\Applications\Altium\Datasheets\R0402_Phycomp_RC0402.pdf; Author: CERN DEM JLC; CreateDate: 03.12.2007; LatestRevisionDate: 17.10.2012
R55-R58 R66-R69 = R0402_1K_1%_0.0625W_100PPM: Resistor - 1%; Part Description: General Purpose Thick Film Chip Resistor; Manufacturer: GENERIC; Manufacturer1 Part Number: 232270671002L; TC: ±100ppm/°C; PressFit: No; Part Number: R0402_1K_1%_0.0625W_100PPM; Component Kind: Standard; Component Type: Standard; Pin Count: 2; Value: 1k; Status: Not Recommended; Power: 0.0625W; Tolerance: ±1%; Manufacturer Part Number: R0402_1K_1%_0.0625W_100PPM; Case: 0402; Mounted: Yes; Sense: No; Socket: No; SMD: Yes; Manufacturer1 Example: YAGEO PHYCOMP; Manufacturer1 ComponentHeight: 0.4mm; HelpURL: \\cern.ch\dfs\Applications\Altium\Datasheets\R0402_Phycomp_RC0402.pdf; Author: CERN DEM JLC; CreateDate: 03.12.2007; LatestRevisionDate: 17.10.2012
T1-T4 = BSS138LT1G: N-CHANNEL MOSFET WITH DIODE; Part Description: 50V 200mA N-Channel Enhancement Mode Field-Effect Transistor; Manufacturer: ON SEMICONDUCTOR; PressFit: No; Bonding: No; Part Number: BSS138LT1G; Component Kind: Standard; Component Type: Standard; Device: BSS138LT1G; PackageDescription: SOT23 3-Leads, Pitch 0.95mm - Body 1.4x3mm, IPC Medium Density; Manufacturer Part Number: BSS138LT1G; Pin Count: 3; Case: SOT23-3; Mounted: Yes; Socket: No; SMD: Yes; Sense: No; ComponentHeight: 1.11mm; HelpURL: \\cern.ch\dfs\Applications\Altium\Datasheets\BSS138LT1G.pdf; Author: CERN DEM JLC; CreateDate: 23.03.2009; LatestRevisionDate: 23.03.2009

## Sheet UART_Driver.SchDoc: Title
size A4; Author: G.Kasprowicz; CompanyName: WUT ISE; DrawnBy: G.Kasprowicz; Organization: WUT ISE; Address1: PW ISE; Address2: Nowowiejska 15/19 00-665 Warsaw; Address3: gkasprow@gmail.com; DocumentNumber: 7; Revision: 2; SheetNumber: 7; SheetTotal: 7; ModifiedBy: -; CheckedDate: -; Title2: Title 2; DivGrp: WUT ISE; Designer: G.Kasprowicz; ModifiedDate: -; ProjectName: Sensor Box
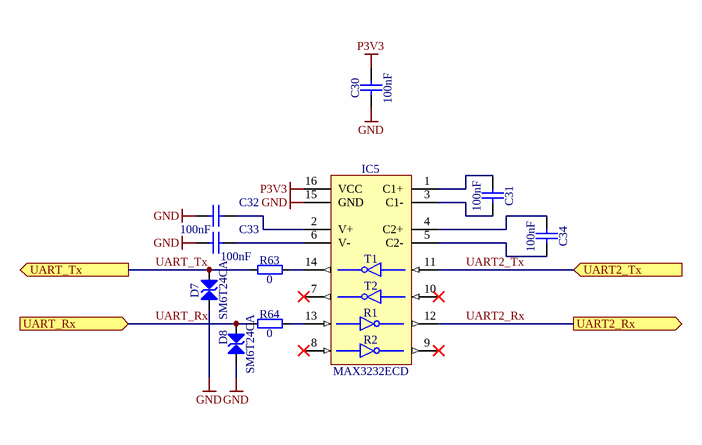
[diagram p6: UART_Driver.SchDoc]

### Parts
C30  100nF  [CAPC1608X87N]
C31  100nF  [CAPC1608X87N]
C32  100nF  [CAPC1608X87N]
C33  100nF  [CAPC1608X87N]
C34  100nF  [CAPC1608X87N]
D7  SM6T24CA  [DIOM5436X265N]
D8  SM6T24CA  [DIOM5436X265N]
IC5  MAX3232ECD  [SOIC127P600X175-16N]
R63  0  [RESC1608X55N]
R64  0  [RESC1608X55N]

### Ports
UART2_Rx (out), UART2_Tx (in), UART_Rx (in), UART_Tx (out)

### Nets
GND: C30.1 C32.2 C33.2 D7.2(A) D8.2(A) IC5.15(GND)
P3V3: C30.2 IC5.16(VCC)
UART2_Rx: IC5.12(R1OUT) ; port UART2_Rx  [project net LA31_P]
UART2_Tx: IC5.11(T1IN) ; port UART2_Tx  [project net LA31_N]
UART_Rx: D8.1(C) R64.1 ; port UART_Rx
UART_Tx: D7.1(C) R63.1 ; port UART_Tx
NetC31_1: C31.1 IC5.3(C1-)
NetC31_2: C31.2 IC5.1(C1+)
NetC32_1: C32.1 IC5.2(V+)
NetC33_1: C33.1 IC5.6(V-)
NetC34_1: C34.1 IC5.5(C2-)
NetC34_2: C34.2 IC5.4(C2+)
NetIC5_13: IC5.13(R1IN) R64.2
NetIC5_14: IC5.14(T1OUT) R63.2

Not connected (* = marked no-connect by the designer): IC5 7(T2OUT)* 8(R2IN)* 9(R2OUT)* 10(T2IN)*

### Notes on the sheet
- Project/Equipment
- Document
- Designer
- Drawn by
- Check.by
- F.Świtakowski
- 01.20201
- PW ISE
- Contact
- File
- Last Mod.
- Print Date
- Sheet
- Size
- A4
- of
- 1
- Rev
- Copyright WUT ISE 2021.
  This documentation describes Open Hardware and is licensed under the CERN OHL v.1.2. You may redistribute and modify this documentation under the terms of the CERN OHL v.1.2. (http://ohwr.org/CERNOHL). This documentation is distributed WITHOUT ANY EXPRESS OR IMPLIED WARRANTY, INCLUDING OF MERCHANTABILITY, SATISFACTORY QUALITY AND FITNESS FOR A PARTICULAR PURPOSE. Please see the CERN OHL v.1.2 for applicable conditions.
- Nowowiejska 15/19 00-665 Warsaw
- (in symbol MAX3232ECD) T1; T2; R1; R2

### Library data of the parts
C30-C34 = CC0603_100NF_50V_10%_X7R: Non-polarised capacitor; Part Description: SMD Multilayer Chip Ceramic Capacitor; Manufacturer: GENERIC; Manufacturer1 Part Number: 223858615649; Voltage: 50V; TC: X7R; Tolerance: ±10%; Part Number: CC0603_100NF_50V_10%_X7R; Component Kind: Standard; Component Type: Standard; Pin Count: 2; Value: 100nF; Status: Preferred; Manufacturer Part Number: CC0603_100NF_50V_10%_X7R; Case: 0603; Mounted: Yes; Socket: No; SMD: Yes; Sense: No; Manufacturer1 Example: PHYCOMP; Manufacturer1 ComponentHeight: 0.87mm; HelpURL: \\cern.ch\dfs\Applications\Altium\Datasheets\CC0603_X7R_PHYCOMP.pdf; Author: CERN DEM JLC; CreateDate: 03.12.2007; LatestRevisionDate: 03.12.2007
D7 D8 = SM6T24CA: Transient Voltage Suppressor Diode (Bi-Directional); Part Description: Bi-Directional Transient Voltage Suppressor Diode; Manufacturer: ST MICROELECTRONICS; Voltage: 24V; Power: 600W; PressFit: No; Bonding: No; Part Number: SM6T24CA; Component Kind: Standard; Component Type: Standard; Device: SM6T24CA; PackageDescription: DO-214-AA/SMB Molded Diode, Body 5.4x3.6mm, IPC Medium Density; Manufacturer Part Number: SM6T24CA; Pin Count: 2; Case: DO-214AA; Mounted: Yes; Socket: No; SMD: Yes; Sense: No; ComponentHeight: 2.65mm; HelpURL: \\cern.ch\dfs\Applications\Altium\Datasheets\SM6T24CA.pdf; Author: CERN DEM JMW; CreateDate: 12.05.2015; LatestRevisionDate: 12.05.2015
IC5 = MAX3232ECD: 3-V To 5.5-V Multichannel RS-232 Line Driver/Receiver With ±15kV IEC ESD Protection; Part Description: 3V To 5.5V Multichannel RS-232 Line Driver/Receiver With ±15kV IEC ESD Protection; Manufacturer: TEXAS INSTRUMENTS; PressFit: No; Bonding: No; Part Number: MAX3232ECD; Component Kind: Standard; Component Type: Standard; Device: MAX3232ECD; PackageDescription: SOIC 16, Pitch 1.27mm - Body 4x10mm, IPC Medium Density; Manufacturer Part Number: MAX3232ECD; Pin Count: 16; Case: SOIC16; Mounted: Yes; Socket: No; SMD: Yes; Sense: No; ComponentHeight: 1.75mm; Author: CERN DEM JLC; HelpURL: \\cern.ch\dfs\Applications\Altium\Datasheets\MAX3232ECD.pdf; CreateDate: 15.07.2010; LatestRevisionDate: 10.01.2012
R63 R64 = R0603_0R_JUMPER: Resistor; Part Description: 1A (0.05R Max DC Resistance) Zero Ohm Jumper; Manufacturer: GENERIC; Manufacturer1 Part Number: NRC06Z0; PressFit: No; Part Number: R0603_0R_JUMPER; Component Kind: Standard; Component Type: Standard; Pin Count: 2; Value: 0; Status: Preferred; Manufacturer Part Number: R0603_0R_JUMPER; Case: 0603; Mounted: Yes; Sense: No; Socket: No; SMD: Yes; Manufacturer1 Example: NIC COMPONENT; Manufacturer1 ComponentHeight: 0.55mm; HelpURL: \\cern.ch\dfs\Applications\Altium\Datasheets\R0603_NIC_NRC.pdf; Author: CERN DEM JLC; CreateDate: 03.12.2007; LatestRevisionDate: 13.03.2008

## Nets that join several sheets
GND: WR_Cute_Carrier_TOP (12 pins), FMC (62 pins), PWR (22 pins), SFP (43 pins), USB_Serial_Quad (54 pins), IO_Buffer (44 pins), UART_Driver (6 pins)
P3V3: WR_Cute_Carrier_TOP (R3.1 R4.1 R6.1), FMC (5 pins), PWR (13 pins), SFP (13 pins), USB_Serial_Quad (8 pins), IO_Buffer (25 pins), UART_Driver (C30.2 IC5.16)
DIR_A: FMC (J8.h35), IO_Buffer (IC3.1 R56.1)
DIR_B: FMC (J8.h38), IO_Buffer (IC3.24 R58.1)
DIR_C: FMC (J8.g27), IO_Buffer (IC4.1 R67.1)
DIR_D: FMC (J8.h32), IO_Buffer (IC4.24 R69.1)
DP0_C2M_N: FMC (J8.c3), SFP (J5.12)
DP0_C2M_P: FMC (J8.c2), SFP (J5.13)
DP0_M2C_N: FMC (J8.c7), SFP (J5.19)
DP0_M2C_P: FMC (J8.c6), SFP (J5.18)
FMC_VADJ: WR_Cute_Carrier_TOP (R3.2), FMC (J8.g39 J8.h40)
GA0: WR_Cute_Carrier_TOP (R4.2 R5.1), FMC (J8.c34)
GA1: WR_Cute_Carrier_TOP (R6.2 R7.1), FMC (J8.d35)
GBTCLK0_M2C_N: WR_Cute_Carrier_TOP (R1.2 TR1.1), FMC (J8.d5)
GBTCLK0_M2C_P: WR_Cute_Carrier_TOP (R1.1 TR1.3), FMC (J8.d4)
IOA: FMC (J8.g36), IO_Buffer (R38.2)
IOB: FMC (J8.h37), IO_Buffer (R43.2)
IOC: FMC (J8.h28), IO_Buffer (R48.2)
IOD: FMC (J8.g30), IO_Buffer (R52.2)
LA05_P: FMC (J8.d11), SFP (J5.3)
LA06_N: FMC (J8.c11), SFP (J5.4 R21.1)
LA06_P: FMC (J8.c10), SFP (J5.2 R20.1)
LA09_N: FMC (J8.d15), SFP (R28.2 T8.1)
LA09_P: FMC (J8.d14), SFP (J5.5 R22.1)
LA10_N: FMC (J8.c15), SFP (R29.2 T9.1)
LA10_P: FMC (J8.c14), SFP (J5.6)
LA14_P: FMC (J8.c18), SFP (J5.8 R25.1)
LA15_N: FMC (J8.h20), IO_Buffer (R62.2 R68.1 T4.1)
LA15_P: FMC (J8.h19), IO_Buffer (R61.2 R66.1 T3.1)
LA19_N: FMC (J8.h23), IO_Buffer (R57.1 R60.2 T2.1)
LA19_P: FMC (J8.h22), IO_Buffer (R55.1 R59.2 T1.1)
LA22_N: FMC (J8.g25), USB_Serial_Quad (IC20.5 TP16.1)
LA22_P: FMC (J8.g24), USB_Serial_Quad (IC20.4 TP17.1)
LA30_P: FMC (J8.h34), IO_Buffer (5 pins)
LA31_N: WR_Cute_Carrier_TOP (B4.1), FMC (J8.g34), UART_Driver (IC5.11)
LA31_P: WR_Cute_Carrier_TOP (B3.1), FMC (J8.g33), UART_Driver (IC5.12)
LEMO_A: WR_Cute_Carrier_TOP (J1.2), IO_Buffer (D3.1 R39.1 R40.2)
LEMO_B: WR_Cute_Carrier_TOP (J1.1), IO_Buffer (D4.1 R42.1 R44.2)
LEMO_C: WR_Cute_Carrier_TOP (J2.2), IO_Buffer (D5.1 R47.1 R49.2)
LEMO_D: WR_Cute_Carrier_TOP (J2.1), IO_Buffer (D6.1 R51.1 R53.2)
NetIC17_4: FMC (J8.d29), USB_Serial_Quad (IC17.4)
NetIC17_5: FMC (J8.d30), USB_Serial_Quad (IC17.5)
NetIC19_4: FMC (J8.d31), USB_Serial_Quad (IC19.4)
NetIC19_5: FMC (J8.d33), USB_Serial_Quad (IC19.5)
SCL: FMC (J8.c30), USB_Serial_Quad (IC22.3 TP19.1)
SDA: FMC (J8.c31), USB_Serial_Quad (IC22.4 TP18.1)
UART_Rx: WR_Cute_Carrier_TOP (B1.1 J7.2), UART_Driver (D8.1 R64.1)
UART_Tx: WR_Cute_Carrier_TOP (B2.1 J7.3), UART_Driver (D7.1 R63.1)

## Assembly variants
Default: not fitted R2 R5 R7 R30 R31